# EAGLE schematic Gamepad (EAGLE 9.2.0)
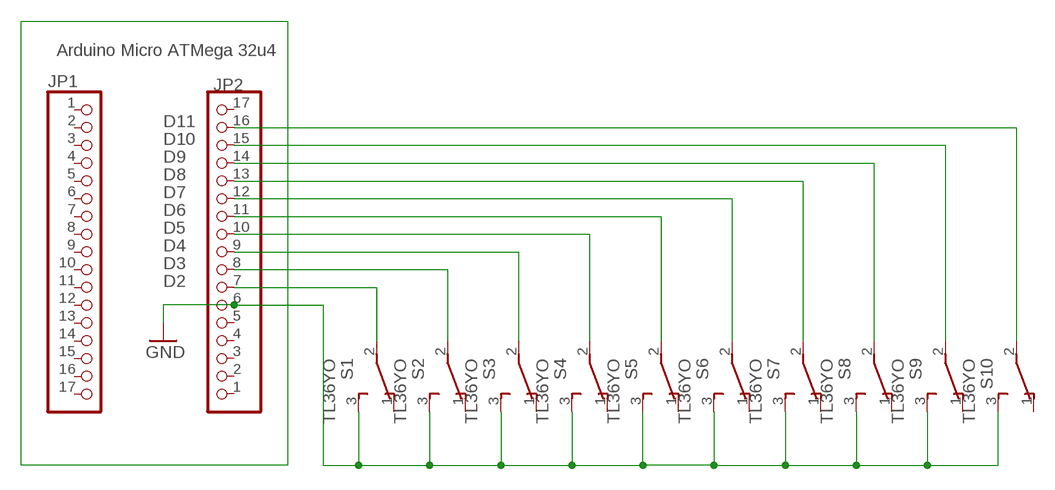
[diagram p0: schematic, sheet 1]

## Parts
JP1  PINHD-1X17  [1X17]
JP2  PINHD-1X17  [1X17]
S1  TL36YO  [TL3XYO]
S2  TL36YO  [TL3XYO]
S3  TL36YO  [TL3XYO]
S4  TL36YO  [TL3XYO]
S5  TL36YO  [TL3XYO]
S6  TL36YO  [TL3XYO]
S7  TL36YO  [TL3XYO]
S8  TL36YO  [TL3XYO]
S9  TL36YO  [TL3XYO]
S10  TL36YO  [TL3XYO]

## Nets
D2: JP2.7 S1.2(P)
D3: JP2.8 S2.2(P)
D4: JP2.9 S3.2(P)
D5: JP2.10 S4.2(P)
D6: JP2.11 S5.2(P)
D7: JP2.12 S6.2(P)
D8: JP2.13 S7.2(P)
D9: JP2.14 S8.2(P)
D10: JP2.15 S9.2(P)
D11: JP2.16 S10.2(P)
GND: JP2.6 S1.3(S) S2.3(S) S3.3(S) S4.3(S) S5.3(S) S6.3(S) S7.3(S) S8.3(S) S9.3(S) S10.3(S)
Unconnected: JP1.1 JP1.2 JP1.3 JP1.4 JP1.5 JP1.6 JP1.7 JP1.8 JP1.9 JP1.10 JP1.11 JP1.12 JP1.13 JP1.14 JP1.15 JP1.16 JP1.17 JP2.1 JP2.2 JP2.3 JP2.4 JP2.5 JP2.17 S1.1(O) S2.1(O) S3.1(O) S4.1(O) S5.1(O) S6.1(O) S7.1(O) S8.1(O) S9.1(O) S10.1(O)

## Notes on the sheet
- Arduino Micro ATMega 32u4

## Library data of the parts
JP1 JP2 = pinhead:PINHD-1X17: PIN HEADER
S1-S10 = switch:TL36YO: TINY SWITCH ON - ON Source: http://www2.produktinfo.conrad.com/datenblaetter/700000-724999/705152-da-01-de-Subminiaturschalter_TL_36YO.pdf